# EAGLE design magic_1.0v (EAGLE 6.5.0)
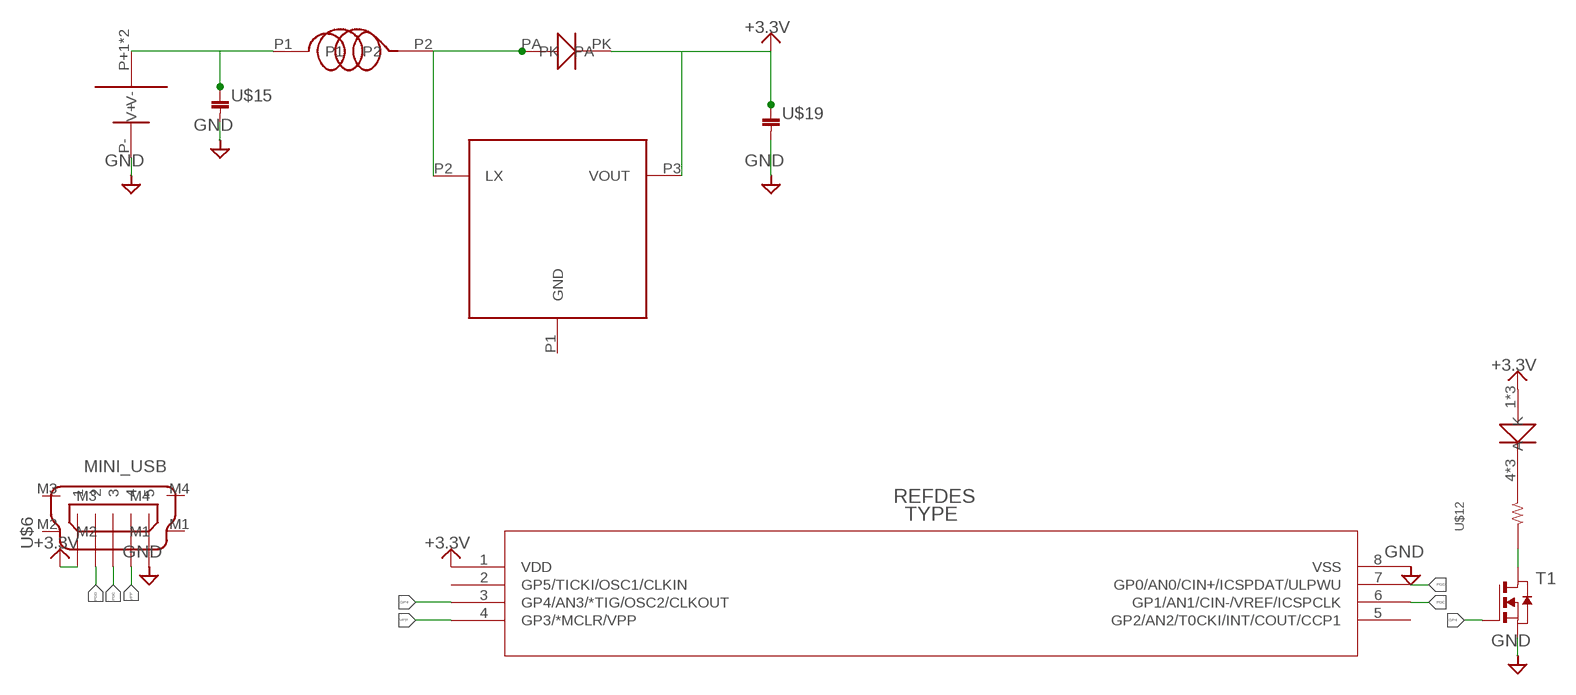
[diagram p0: schematic, sheet 1]

## Parts
T1  NMOSSOT23  [SOT-23]
U$1  PIC12F683-X/SN  [SOIC8-N_MC]
U$2  CR2032  [SMTM2032]
U$6  MINI_USB  [MINI_USB]
U$9  OSB64  [ＯＳＢ６４]
U$12  RESISTOR__SMD  [1608]
U$13  NPI16W  [NPI16W]
U$14  HT7733  [SOT23]
U$15  3225  [3225]
U$17  RSX101  [TUMD2]
U$19  2012  [2012]

## Nets
+3.3V: U$1.1(VDD) U$6.1 U$9.1(A) U$9.2(A) U$9.3(A) U$14.P3(VOUT) U$17.PK U$19.1
GND: T1.2(S) U$1.8(VSS) U$2.P-(V-) U$6.5 U$15.P$2 U$19.2
GP4: T1.3(G) U$1.3(GP4/AN3/*TIG/OSC2/CLKOUT)
N$1: U$9.4(K) U$9.5(K) U$9.6(K) U$12.2
N$2: T1.1(D) U$12.1
N$3: U$2.P+1(V+) U$2.P+2(V+) U$13.P1 U$15.P$1
N$4: U$13.P2 U$14.P2(LX) U$17.PA
PGC: U$1.6(GP1/AN1/CIN-/VREF/ICSPCLK) U$6.3
PGD: U$1.7(GP0/AN0/CIN+/ICSPDAT/ULPWU) U$6.2
VPP: U$1.4(GP3/*MCLR/VPP) U$6.4
Unconnected: U$1.2(GP5/TICKI/OSC1/CLKIN) U$1.5(GP2/AN2/T0CKI/INT/COUT/CCP1) U$6.M1 U$6.M2 U$6.M3 U$6.M4 U$14.P1(GND)

## Library data of the parts
T1 = zetex:NMOSSOT23: MOS FET; OC_FARNELL: unknown; OC_NEWARK: unknown
U$1 = microchip:PIC12F683-X/SN
U$2 = battery:CR2032
U$6 = 08_CONECTOR:MINI_USB
U$9 = LED:OSB64
U$12 = 01_R:RESISTOR__SMD
U$13 = INDUCTOR:NPI16W
U$14 = 04_IC:HT7733
U$15 = 02_C:3225
U$17 = DIODE:RSX101
U$19 = 02_C:2012

## Board
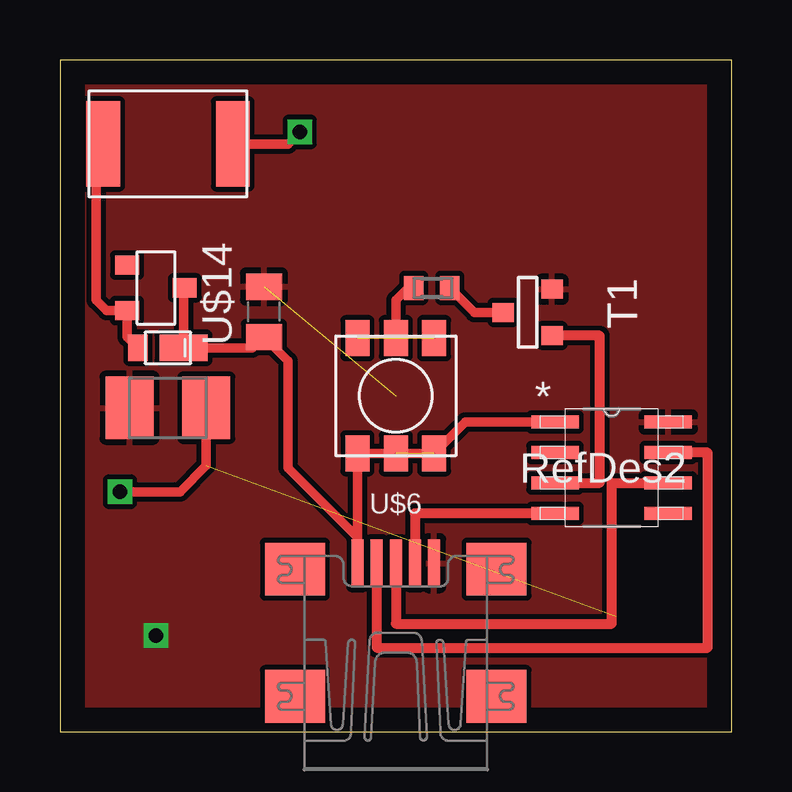
[diagram p1: board, top side]
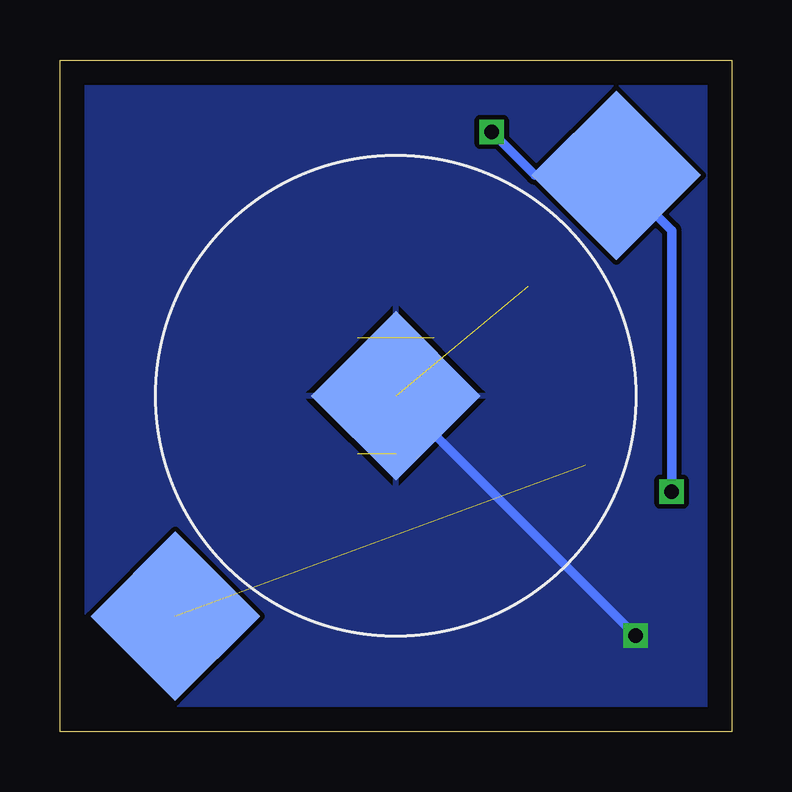
[diagram p2: board, bottom side, seen from below]

Size 28 x 28 mm. Coordinates in mm from the lower left corner, seen from the top.
Outline: 0,0 28,0 28,28 0,28 0,0
Copper layers (1*16): Top 0.035mm / dielectric 1.5mm / Bottom 0.035mm
Design rules "default": minimum track width 10mil, minimum drill 24mil, track to track 8mil, track to pad 8mil, pad to pad 8mil, via to via 8mil, smd to smd 8mil, copper to edge 40mil, drill to drill 8mil, minimum pad ring 10mil, minimum via ring 8mil, stop-mask expansion 4mil, vias tented up to drill 0mil, thermal gap 10mil

### Footprints (pad centres in the part's own frame; a part is rotated, then mirrored left to right if it is on the bottom)
SOT-23 = smd 0.787 x 0.889: 1 0.025,-1.016; 2 -0.94,1.016; 3 0.991,1.016
SOIC8-N_MC = smd 1.981 x 0.559: 1 -2.362,1.905; 2 -2.362,0.635; 3 -2.362,-0.635; 4 -2.362,-1.905; 5 2.362,-1.905; 6 2.362,-0.635; 7 2.362,0.635; 8 2.362,1.905
SMTM2032 = smd 5 x 5: P+1 -13,0; P+2 13,0; P- 0,0
MINI_USB = smd 2 x 0.5: 1 3.52,1.6; 2 3.52,0.8; 3 3.52,0; 4 3.52,-0.8; 5 3.52,-1.6 | smd 2.2 x 2.5: M1 -2.03,-4.2; M2 -2.03,4.2; M3 3.27,4.2; M4 3.27,-4.2
ＯＳＢ６４ = smd 1 x 1.5: 1 -1.6,-2.4; 2 0,-2.4; 3 1.6,-2.4; 4 1.6,2.4; 5 0,2.4; 6 -1.6,2.4
1608 = smd 0.8 x 1: 1 -0.75,0; 2 0.75,0
NPI16W = smd 1.4 x 3.56: P1 2.7,0; P2 -2.7,0
SOT23 = smd 0.8 x 1: P1 -0.95,-1.2; P2 0.95,-1.2; P3 0,1.2
3225 = smd 2 x 2.6: P$1 -1.6,0; P$2 1.6,0
TUMD2 = smd 1.1 x 0.8: PA 0,-1.25 | smd 1.1 x 2: PK 0,0.65
2012 = smd 1.1 x 1.5: 1 -1.05,0; 2 1.05,0

### Placement (x,y rotation side)
T1  19.5,17.5 270 top
U$1  23,11 0 top
U$2  14,14 45 bottom
U$6  14,3.5 90 top
U$9  14,14 0 top
U$12  15.5,18.5 180 top
U$13  4.5,24.5 0 top
U$14  4,18.5 270 top
U$15  4.5,13.5 180 top
U$17  4.5,16 270 top
U$19  8.5,17.5 90 top

### Tracks (layer width: path | path; a pad name or v marks a point on that pad's centre or on a via)
+3.3V  (1 unrouted)
  Top 0.4: U$14.P3 5.15,18.45 U$17.PK 8,16 8.45,16.45 U$19.1 9.5,15.45 9.5,11 12.4,8.1 U$6.1 U$9.1 U$9.3 16.91,12.9 U$1.1
GND  (via drill 0.6)  (1 unrouted)
  Bottom 0.4: U$2.P- v4,4
  pour Top: 0,28 28,28 28,0 0,0
  pour Bottom: 0,28 28,28 28,0 0,0
GP4
  Top 0.406: U$1.3 22.5,10.37 22.5,16.51 T1.3
N$1  (2 unrouted)
  Top 0.4: U$9.5 14,18 14.5,18.5 U$12.2
N$2
  Top 0.4: U$12.1 17.27,17.48 T1.1
N$3  (via drill 0.6)  (1 unrouted)
  Top 0.4: v10,25 9.5,24.5 U$13.P1 | v2.5,10 5,10 6.1,11.1 U$15.P$1
  Bottom 0.4: v10,25 8.19,23.19 U$2.P+2 2.5,20.89 v2.5,10
N$4
  Top 0.4: U$17.PA 2.8,16.45 U$14.P2 1.95,17.55 1.5,18 1.5,24.2 U$13.P2
PGC
  Top 0.406: U$6.3 14,4.5 23,4.5 23,10.37 U$1.6
PGD
  Top 0.406: U$6.2 13.2,3.5 27,3.5 27,11.63 U$1.7
VPP
  Top 0.406: U$1.4 14.8,9.1 U$6.4